# EAGLE schematic PCB_schematic (EAGLE 9.7.0)
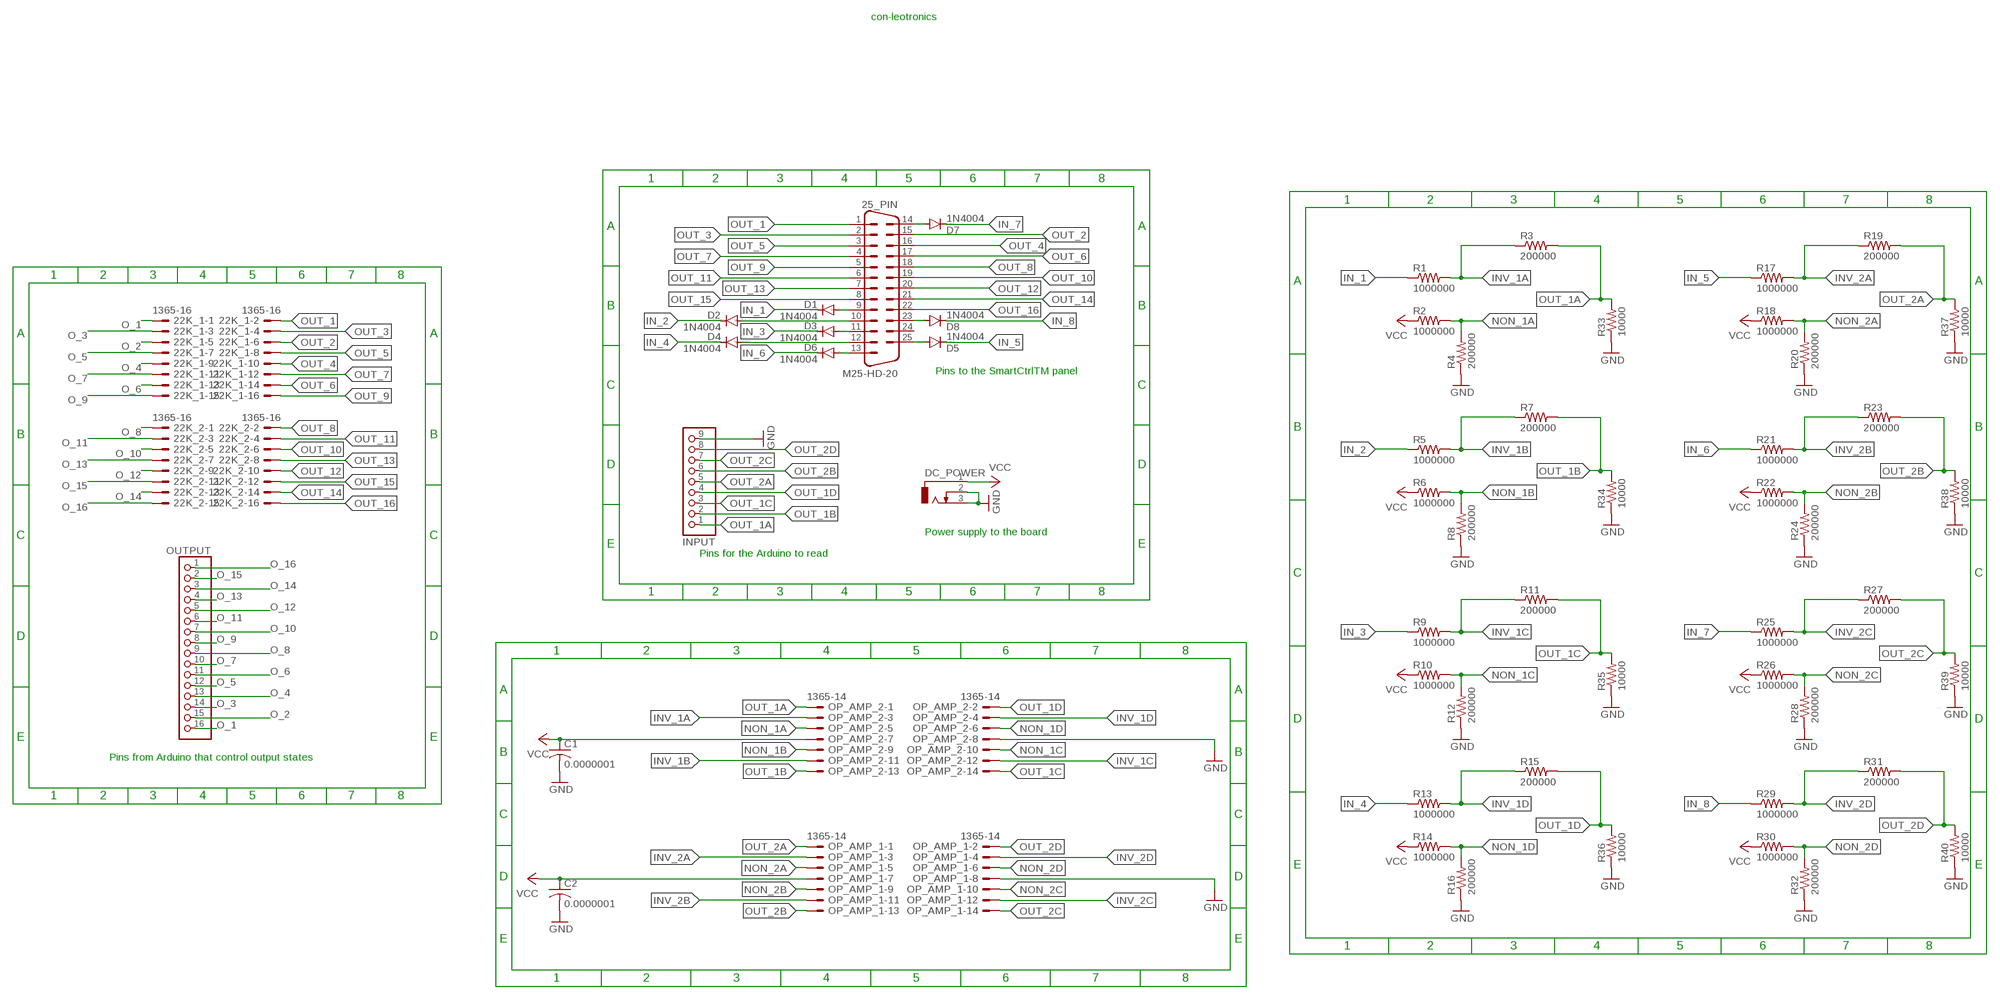
[diagram p0: schematic, sheet 1]

## Parts
22K_1  1365-16  [1365-16]
22K_2  1365-16  [1365-16]
25_PIN  M25-HD-20  [M25-HD-20]
C1  0.0000001  C-USC1206  [C1206]
C2  0.0000001  C-USC1206  [C1206]
D1  1N4004  [DO41-10]
D2  1N4004  [DO41-10]
D3  1N4004  [DO41-10]
D4  1N4004  [DO41-10]
D5  1N4004  [DO41-10]
D6  1N4004  [DO41-10]
D7  1N4004  [DO41-10]
D8  1N4004  [DO41-10]
DC_POWER  DCJ0303  [DCJ0303]
INPUT  PINHD-1X9  [1X09]
OP_AMP_1  1365-14  [1365-14]
OP_AMP_2  1365-14  [1365-14]
OUTPUT  PINHD-1X16  [1X16]
R1  1000000  R-US_R1206  [R1206]
R2  1000000  R-US_R1206  [R1206]
R3  200000  R-US_R1206  [R1206]
R4  200000  R-US_R1206  [R1206]
R5  1000000  R-US_R1206  [R1206]
R6  1000000  R-US_R1206  [R1206]
R7  200000  R-US_R1206  [R1206]
R8  200000  R-US_R1206  [R1206]
R9  1000000  R-US_R1206  [R1206]
R10  1000000  R-US_R1206  [R1206]
R11  200000  R-US_R1206  [R1206]
R12  200000  R-US_R1206  [R1206]
R13  1000000  R-US_R1206  [R1206]
R14  1000000  R-US_R1206  [R1206]
R15  200000  R-US_R1206  [R1206]
R16  200000  R-US_R1206  [R1206]
R17  1000000  R-US_R1206  [R1206]
R18  1000000  R-US_R1206  [R1206]
R19  200000  R-US_R1206  [R1206]
R20  200000  R-US_R1206  [R1206]
R21  1000000  R-US_R1206  [R1206]
R22  1000000  R-US_R1206  [R1206]
R23  200000  R-US_R1206  [R1206]
R24  200000  R-US_R1206  [R1206]
R25  1000000  R-US_R1206  [R1206]
R26  1000000  R-US_R1206  [R1206]
R27  200000  R-US_R1206  [R1206]
R28  200000  R-US_R1206  [R1206]
R29  1000000  R-US_R1206  [R1206]
R30  1000000  R-US_R1206  [R1206]
R31  200000  R-US_R1206  [R1206]
R32  200000  R-US_R1206  [R1206]
R33  10000  R-US_R1206  [R1206]
R34  10000  R-US_R1206  [R1206]
R35  10000  R-US_R1206  [R1206]
R36  10000  R-US_R1206  [R1206]
R37  10000  R-US_R1206  [R1206]
R38  10000  R-US_R1206  [R1206]
R39  10000  R-US_R1206  [R1206]
R40  10000  R-US_R1206  [R1206]

## Nets
GND: C1.2 C2.2 DC_POWER.2 DC_POWER.3 INPUT.9 OP_AMP_1.8 OP_AMP_2.8 R4.1 R8.1 R12.1 R16.1 R20.1 R24.1 R28.1 R32.1 R33.1 R34.1 R35.1 R36.1 R37.1 R38.1 R39.1 R40.1
IN_1: D1.C R1.1
IN_2: D2.C R5.1
IN_3: D3.C R9.1
IN_4: D4.C R13.1
IN_5: D5.C R17.1
IN_6: D6.C R21.1
IN_7: D7.C R25.1
IN_8: D8.C R29.1
INV_1A: OP_AMP_2.3 R1.2 R3.1
INV_1B: OP_AMP_2.11 R5.2 R7.1
INV_1C: OP_AMP_2.12 R9.2 R11.1
INV_1D: OP_AMP_2.4 R13.2 R15.1
INV_2A: OP_AMP_1.3 R17.2 R19.1
INV_2B: OP_AMP_1.11 R21.2 R23.1
INV_2C: OP_AMP_1.12 R25.2 R27.1
INV_2D: OP_AMP_1.4 R29.2 R31.1
N$1: 25_PIN.9 D1.A
N$2: 25_PIN.10 D2.A
N$3: 25_PIN.11 D3.A
N$4: 25_PIN.12 D4.A
N$5: 25_PIN.25 D5.A
N$6: 25_PIN.13 D6.A
N$7: 25_PIN.23 D8.A
N$8: 25_PIN.14 D7.A
NON_1A: OP_AMP_2.5 R2.2 R4.2
NON_1B: OP_AMP_2.9 R6.2 R8.2
NON_1C: OP_AMP_2.10 R10.2 R12.2
NON_1D: OP_AMP_2.6 R14.2 R16.2
NON_2A: OP_AMP_1.5 R18.2 R20.2
NON_2B: OP_AMP_1.9 R22.2 R24.2
NON_2C: OP_AMP_1.10 R26.2 R28.2
NON_2D: OP_AMP_1.6 R30.2 R32.2
O_1: 22K_1.1 OUTPUT.16
O_2: 22K_1.5 OUTPUT.15
O_3: 22K_1.3 OUTPUT.14
O_4: 22K_1.9 OUTPUT.13
O_5: 22K_1.7 OUTPUT.12
O_6: 22K_1.13 OUTPUT.11
O_7: 22K_1.11 OUTPUT.10
O_8: 22K_2.1 OUTPUT.9
O_9: 22K_1.15 OUTPUT.8
O_10: 22K_2.5 OUTPUT.7
O_11: 22K_2.3 OUTPUT.6
O_12: 22K_2.9 OUTPUT.5
O_13: 22K_2.7 OUTPUT.4
O_14: 22K_2.13 OUTPUT.3
O_15: 22K_2.11 OUTPUT.2
O_16: 22K_2.15 OUTPUT.1
OUT_1: 22K_1.2 25_PIN.1
OUT_1A: INPUT.1 OP_AMP_2.1 R3.2 R33.2
OUT_1B: INPUT.2 OP_AMP_2.13 R7.2 R34.2
OUT_1C: INPUT.3 OP_AMP_2.14 R11.2 R35.2
OUT_1D: INPUT.4 OP_AMP_2.2 R15.2 R36.2
OUT_2: 22K_1.6 25_PIN.15
OUT_2A: INPUT.5 OP_AMP_1.1 R19.2 R37.2
OUT_2B: INPUT.6 OP_AMP_1.13 R23.2 R38.2
OUT_2C: INPUT.7 OP_AMP_1.14 R27.2 R39.2
OUT_2D: INPUT.8 OP_AMP_1.2 R31.2 R40.2
OUT_3: 22K_1.4 25_PIN.2
OUT_4: 22K_1.10 25_PIN.16
OUT_5: 22K_1.8 25_PIN.3
OUT_6: 22K_1.14 25_PIN.17
OUT_7: 22K_1.12 25_PIN.4
OUT_8: 22K_2.2 25_PIN.18
OUT_9: 22K_1.16 25_PIN.5
OUT_10: 22K_2.6 25_PIN.19
OUT_11: 22K_2.4 25_PIN.6
OUT_12: 22K_2.10 25_PIN.20
OUT_13: 22K_2.8 25_PIN.7
OUT_14: 22K_2.14 25_PIN.21
OUT_15: 22K_2.12 25_PIN.8
OUT_16: 22K_2.16 25_PIN.22
VCC: C1.1 C2.1 DC_POWER.1 OP_AMP_1.7 OP_AMP_2.7 R2.1 R6.1 R10.1 R14.1 R18.1 R22.1 R26.1 R30.1
Unconnected: 25_PIN.24

## Notes on the sheet
- con-leotronics
- Pins to the SmartCtrlTM panel
- Power supply to the board
- Pins for the Arduino to read
- Pins from Arduino that control output states

## Library data of the parts
22K_1 22K_2 = con-leotronics:1365-16: DUAL ROW STRAIGHT HEADER 1364 SERIES. 1.27mm x 1.27mm. Without Fixing Post. SMT Source: http://www.leotronics.co.uk/Conexcon/Data%20Sheets/sec.%20A/1364ing.pdf; OC_FARNELL: unknown; OC_NEWARK: unknown
25_PIN = con-subd:M25-HD-20: HD-20 Front Metal-Shell Right-Angle Posted Connectors 318 Mount 5747846-6 Source: http://catalog.tycoelectronics.com/TE/bin/TE.Connect?C=1&M=BYPN&TCPN=5747846-6&RQPN=5747846-6; OC_FARNELL: unknown; OC_NEWARK: unknown
C1 C2 = rcl:C-US: CAPACITOR, American symbol; SPICEPREFIX: C
D1-D8 = diode:1N4004: DIODE general purpose rectifier, 1 A
DC_POWER = con-jack:DCJ0303: DC POWER JACK Source: DCJ0303.pdf; OC_FARNELL: unknown; OC_NEWARK: unknown
INPUT = pinhead:PINHD-1X9: PIN HEADER
OP_AMP_1 OP_AMP_2 = con-leotronics:1365-14: DUAL ROW STRAIGHT HEADER 1364 SERIES. 1.27mm x 1.27mm. Without Fixing Post. SMT Source: http://www.leotronics.co.uk/Conexcon/Data%20Sheets/sec.%20A/1364ing.pdf; OC_FARNELL: unknown; OC_NEWARK: unknown
OUTPUT = pinhead:PINHD-1X16: PIN HEADER
R1-R40 = rcl:R-US_: RESISTOR, American symbol; SPICEPREFIX: R